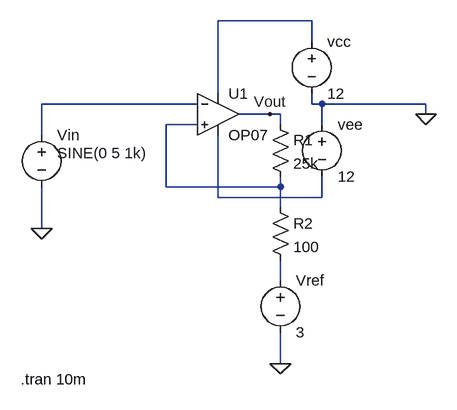
[diagram p0: schematic Schemitt Trigger.asc]
Schemitt Trigger.asc, the LTspice schematic file:
Version 4.1
SHEET 1 880 680
WIRE 368 16 224 16
WIRE 368 48 368 16
WIRE 224 128 224 16
WIRE 192 144 -48 144
WIRE 368 144 368 128
WIRE 384 144 368 144
WIRE 544 144 384 144
WIRE 304 160 256 160
WIRE 320 160 304 160
WIRE 544 160 544 144
WIRE 192 176 144 176
WIRE 320 176 320 160
WIRE 384 176 384 144
WIRE -48 192 -48 144
WIRE 144 272 144 176
WIRE 320 272 320 256
WIRE 320 272 144 272
WIRE 224 288 224 192
WIRE 384 288 384 256
WIRE 384 288 224 288
WIRE 320 304 320 272
WIRE -48 336 -48 272
WIRE 320 416 320 384
WIRE 320 544 320 496
FLAG 544 160 0
FLAG 320 544 0
FLAG 304 160 Vout
FLAG -48 336 0
SYMBOL OpAmps\\OP07 224 96 R0
SYMATTR InstName U1
SYMBOL voltage 368 32 R0
SYMATTR InstName vcc
SYMATTR Value 12
SYMBOL voltage 384 160 R0
SYMATTR InstName vee
SYMATTR Value 12
SYMBOL res 304 160 R0
SYMATTR InstName R1
SYMATTR Value 25k
SYMBOL res 304 288 R0
SYMATTR InstName R2
SYMATTR Value 100
SYMBOL voltage 320 400 R0
SYMATTR InstName Vref
SYMATTR Value 3
SYMBOL voltage -48 176 R0
WINDOW 3 24 44 Left 2
WINDOW 123 0 0 Left 0
WINDOW 39 0 0 Left 0
SYMATTR InstName Vin
SYMATTR Value SINE(0 5 1k)
TEXT -80 568 Left 2 !.tran 10m

The netlist it stands for:
* Schemitt Trigger.asc
X§U1 N003 N002 N001 N004 Vout LT1001  ; OP07, pins In+ In- V+ V- OUT
vcc N001 0 12
vee 0 N004 12
R1 Vout N003 25k
R2 N003 N005 100
Vref N005 0 3
Vin N002 0 SINE(0 5 1k)
.tran 10m
.lib LTC.lib
.backanno
.end